# Altium schematic sheet pre_amplify.SchDoc
size A4
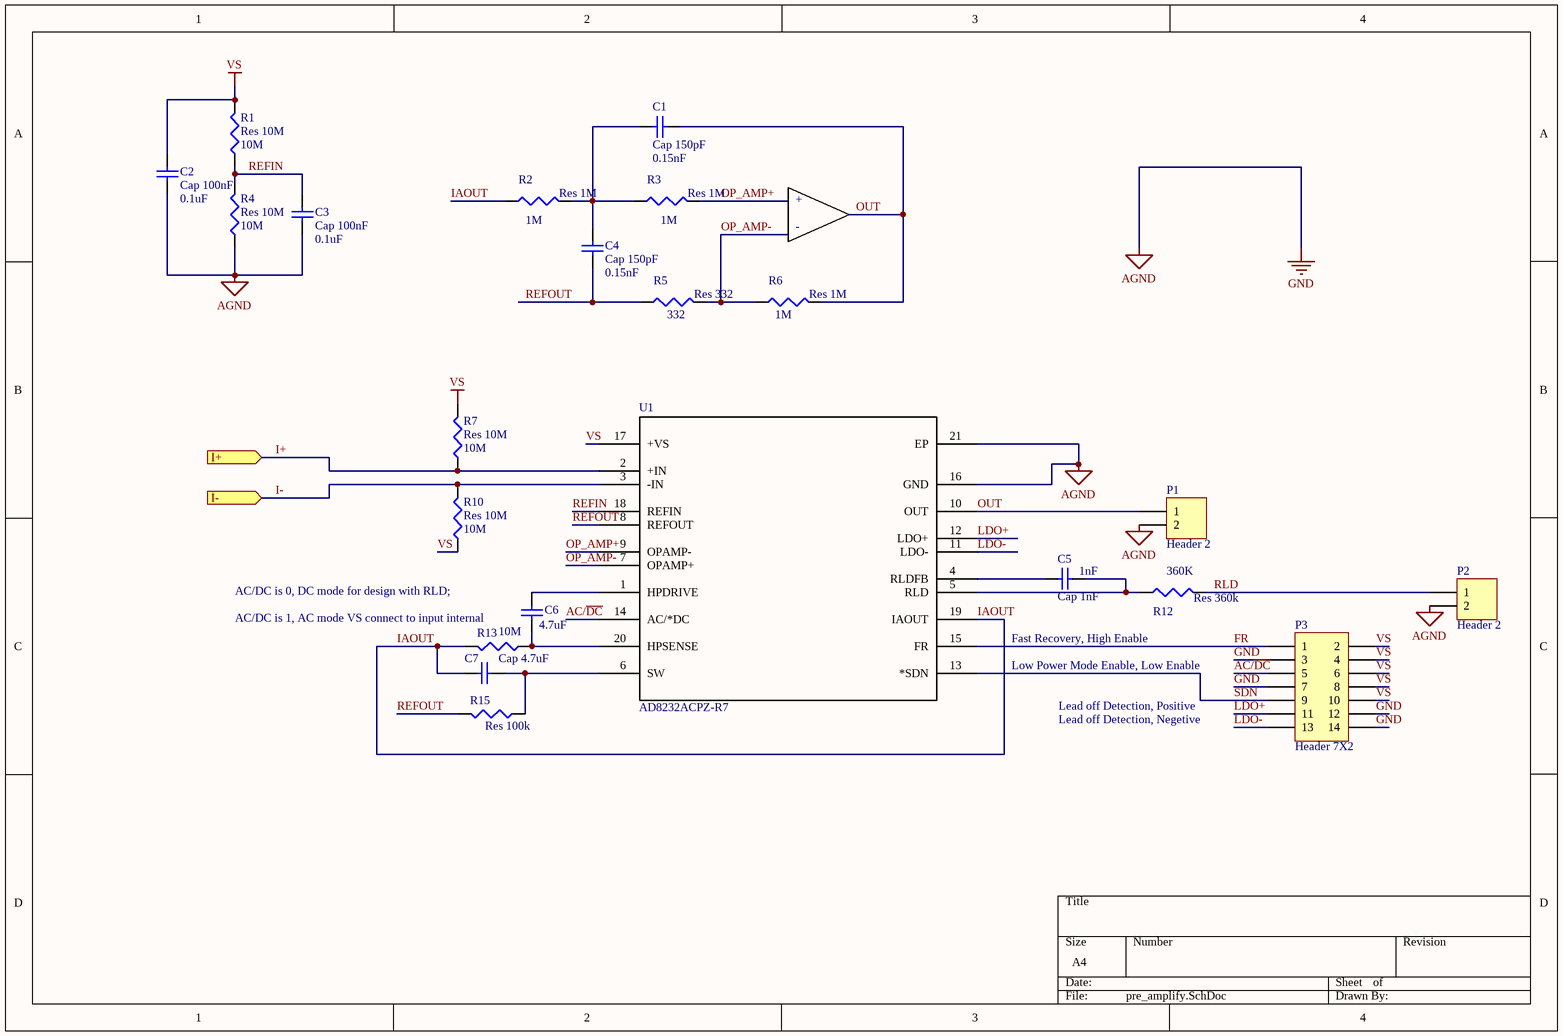
[diagram p0: pre_amplify.SchDoc]

## Parts
C1  Cap 150pF  value 0.15nF  [0402]
C2  Cap 100nF  value 0.1uF  [0402]
C3  Cap 100nF  value 0.1uF  [0402]
C4  Cap 150pF  value 0.15nF  [0402]
C5  Cap 1nF  value 1nF  [0402]
C6  value 4.7uF  [0402]  (hidden comment: Cap 4.7uF)
C7  Cap 4.7uF  [0402]
P1  Header 2  [HDR1X2]
P2  Header 2  [HDR1X2]
P3  Header 7X2  [HDR2X7]
R1  Res 10M  value 10M  [0402]
R2  Res 1M  value 1M  [0402]
R3  Res 1M  value 1M  [0402]
R4  Res 10M  value 10M  [0402]
R5  Res 332  value 332  [0402]
R6  Res 1M  value 1M  [0402]
R7  Res 10M  value 10M  [0402]
R10  Res 10M  value 10M  [0402]
R12  Res 360k  value 360K  [0402]
R13  value 10M  [0402]  (hidden comment: Res 10M)
R15  Res 100k  [0402]
U1  AD8232ACPZ-R7  [CP_20_10]

## Ports
I+ (in), I- (in)

## Nets
GND: C2.1 C3.1 P1.2 P2.2 P3.3 P3.7 P3.12 P3.14 R4.1 U1.16(GND) U1.21(EP)  [also labelled AGND]
VS: C2.2 P3.2 P3.4 P3.6 P3.8 P3.10 R1.2 R7.2 R10.1 U1.17(+VS)
AC/~{DC}: P3.5 U1.14(AC/*DC)
FR: P3.1 U1.15(FR)
I+: R7.1 U1.2(+IN) ; port I+
I-: R10.2 U1.3(-IN) ; port I-
IAOUT: C7.2 R2.1 R13.2 U1.19(IAOUT)
LDO+: P3.11 U1.12(LDO+)
LDO-: P3.13 U1.11(LDO-)
OP_AMP+: R3.2 U1.9(OPAMP-)
OP_AMP-: R5.2 R6.1 U1.7(OPAMP+)
OUT: C1.1 P1.1 R6.2 U1.10(OUT)
REFIN: C3.2 R1.1 R4.2 U1.18(REFIN)
REFOUT: C4.2 R5.1 R15.2 U1.8(REFOUT)
RLD: P2.1 R12.2
SDN: P3.9 U1.13(*SDN)
NetC1_2: C1.2 C4.1 R2.2 R3.1
NetC5_1: C5.1 R12.1 U1.5(RLD)
NetC5_2: C5.2 U1.4(RLDFB)
NetC6_1: C6.1 R13.1 U1.20(HPSENSE)
NetC6_2: C6.2 U1.1(HPDRIVE)
NetC7_1: C7.1 R15.1 U1.6(SW)

## Notes on the sheet
- +
- -
- AC/DC is 0, DC mode for design with RLD;
- (near C6) AC/DC is 1, AC mode VS connect to input internal
- Fast Recovery, High Enable
- Low Power Mode Enable, Low Enable
- Lead off Detection, Positive
- Lead off Detection, Negetive

## Library data of the parts
C1-C7 = Cap Semi: Capacitor (Semiconductor SIM Model); Published: 8-Jun-2000; LatestRevisionDate: 29-May-2009; LatestRevisionNote: IPC-7351 Footprint Added.; PackageReference: C1206; Publisher: Altium Limited; PackageDescription: Chip Capacitor
P1 P2 = Header 2: Header, 2-Pin; LatestRevisionDate: 17-Jul-2002; LatestRevisionNote: Re-released for DXP Platform.; Publisher: Altium Limited
P3 = Header 7X2: Power, Control and Info Connection; LatestRevisionDate: 17-Jul-2002; LatestRevisionNote: Re-released for DXP Platform.; Publisher: Altium Limited
R1-R7 R10 R12 R13 R15 = Res3: Resistor; Published: 8-Jun-2000; LatestRevisionDate: 29-May-2009; LatestRevisionNote: IPC-7351 Footprint Added.; PackageReference: J1-0603; Publisher: Altium Limited; PackageDescription: Chip Resistor
U1 = AD8232ACPZ-R7: Imported; RefDes: RefDes; Type: DEV; Value: Value